# EAGLE design LB_BIT_2IN_1OUT-XL-v03(1_1x) (EAGLE 6.5.0)
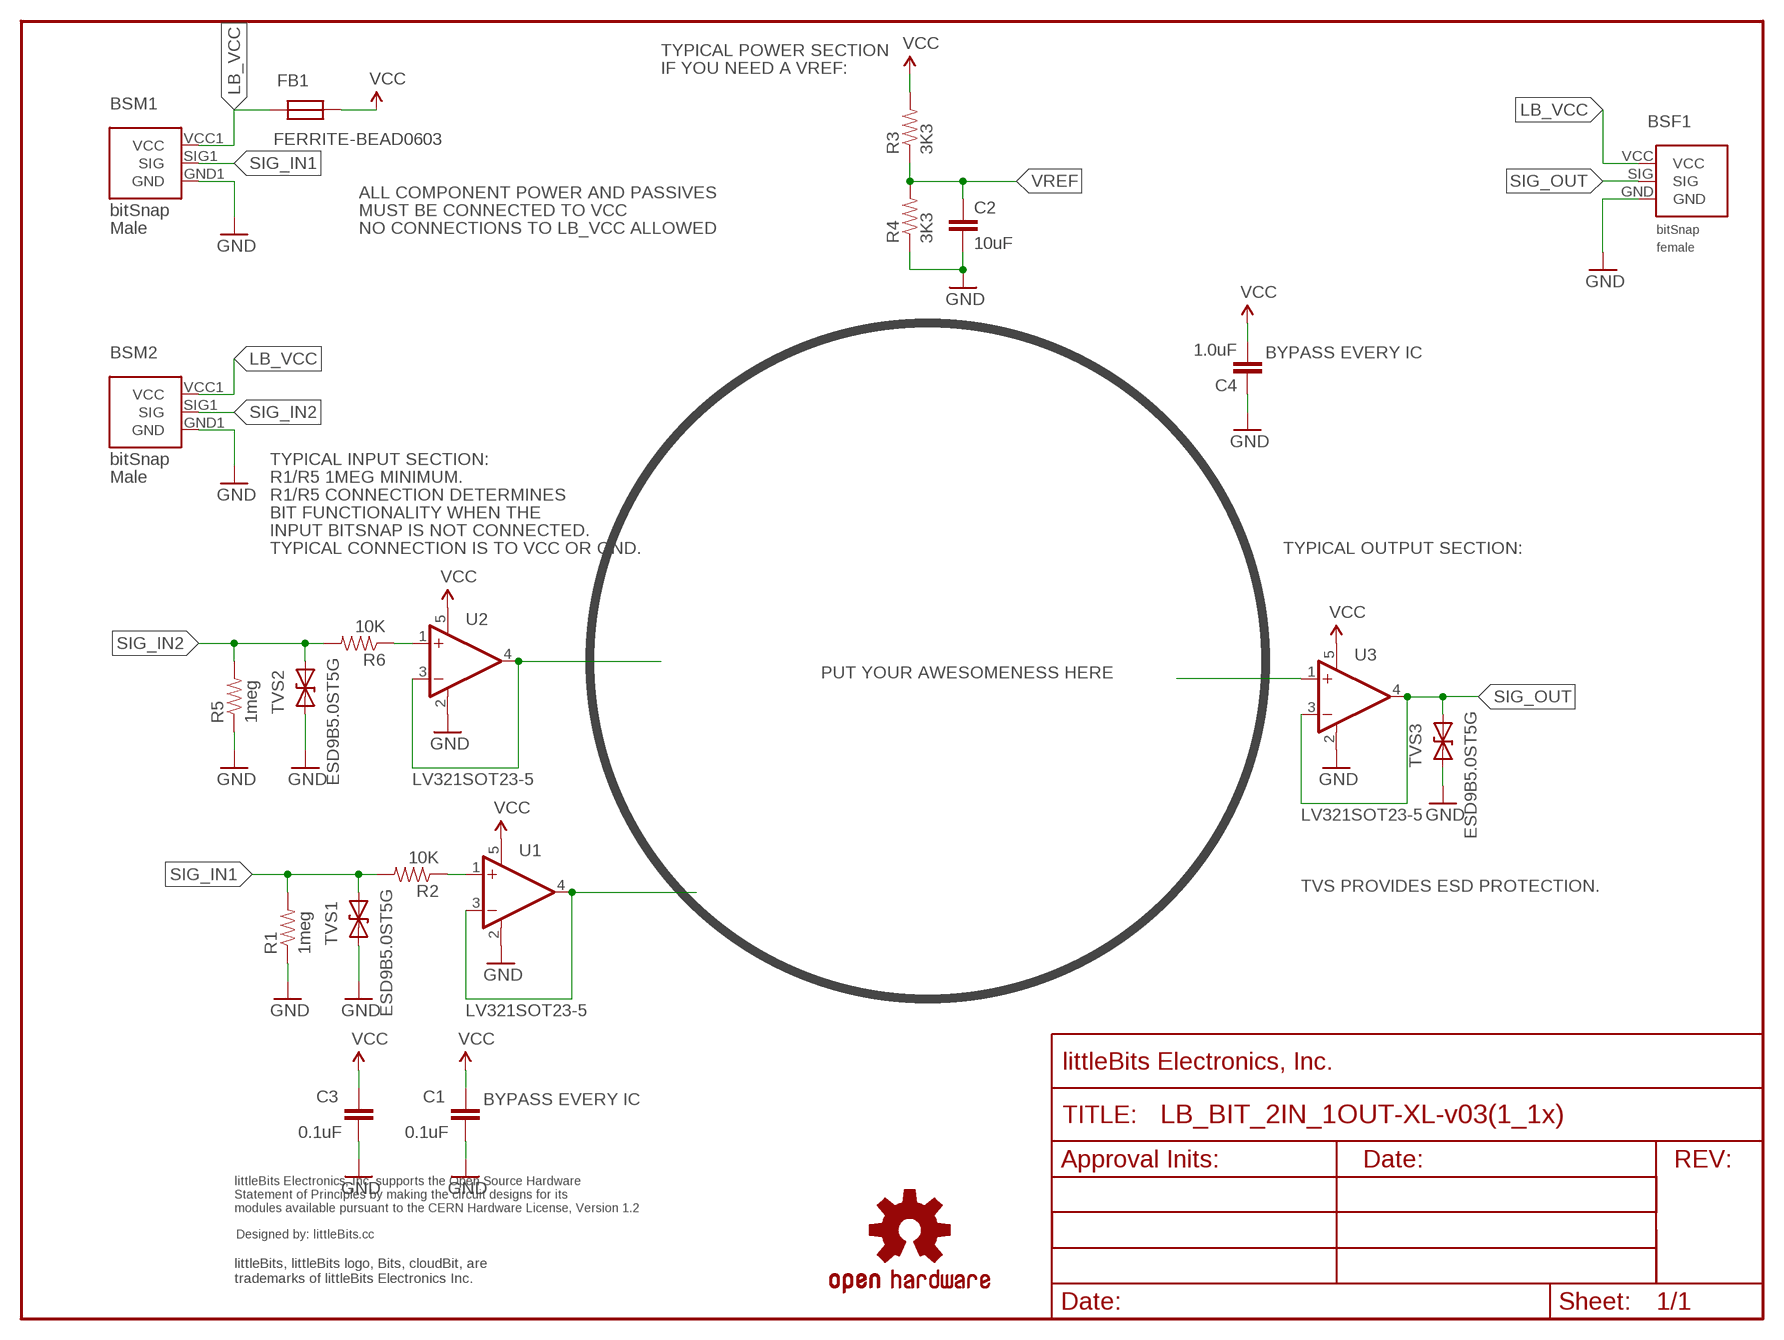
[diagram p0: schematic, sheet 1]

## Parts
BSF1  BITSNAP_V03_FEMALE  [BITSNAP_V03_FEMALE]
BSM1  BITSNAP_V03_MALE  [BITSNAP_V03_MALE]
BSM2  BITSNAP_V03_MALE  [BITSNAP_V03_MALE]
C1  0.1uF  CAPCAP-0603  [CAP-0603]
C2  10uF  CAPCAP-0603  [CAP-0603]
C3  0.1uF  CAPCAP-0603  [CAP-0603]
C4  1.0uF  CAPCAP-0603  [CAP-0603]
FB1  FERRITE-BEAD0603  [R0603]
FRAME1  FRAME-LETTER  [FABDWG01-OHW]
R1  1meg  RESISTOR0603  [RES-0603]
R2  10K  RESISTOR0603  [RES-0603]
R3  3K3  RESISTOR0603  [RES-0603]
R4  3K3  RESISTOR0603  [RES-0603]
R5  1meg  RESISTOR0603  [RES-0603]
R6  10K  RESISTOR0603  [RES-0603]
TVS1  ESD9B5.0ST5G  DIODE-TVSSOD-923  [SOD-923]
TVS2  ESD9B5.0ST5G  DIODE-TVSSOD-923  [SOD-923]
TVS3  ESD9B5.0ST5G  DIODE-TVSSOD-923  [SOD-923]
U1  LV321SOT23-5  [SOT23-5]
U2  LV321SOT23-5  [SOT23-5]
U3  LV321SOT23-5  [SOT23-5]
U$1  OSHW-LOGOL  [OSHW-LOGO-L]
U$3  OSHWCREDIT  [OSHWCREDIT]

## Nets
GND: BSF1.GND BSM1.GND1(GND) BSM2.GND1(GND) C1.2 C2.2 C3.2 C4.1 R1.1 R4.1 R5.1 TVS1.1(A) TVS2.1(A) TVS3.1(A) U1.2(V-) U2.2(V-) U3.2(V-)
LB_VCC: BSF1.VCC BSM1.VCC1(VCC) BSM2.VCC1(VCC) FB1.2
N$1: U2.3(-IN) U2.4(OUT)
N$2: R6.1 U2.1(+IN)
N$3: U1.3(-IN) U1.4(OUT)
N$4: R2.1 U1.1(+IN)
N$12: U3.1(+IN)
SIG_IN1: BSM1.SIG1(SIG) R1.2 R2.2 TVS1.2(C)
SIG_IN2: BSM2.SIG1(SIG) R5.2 R6.2 TVS2.2(C)
SIG_OUT: BSF1.SIG TVS3.2(C) U3.3(-IN) U3.4(OUT)
VCC: C1.1 C3.1 C4.2 FB1.1 R3.2 U1.5(V+) U2.5(V+) U3.5(V+)
VREF: C2.1 R3.1 R4.2

## Notes on the sheet
- TYPICAL POWER SECTION
- IF YOU NEED A VREF:
- ALL COMPONENT POWER AND PASSIVES
- MUST BE CONNECTED TO VCC
- NO CONNECTIONS TO LB_VCC ALLOWED
- BYPASS EVERY IC
- TYPICAL INPUT SECTION:
- R1/R5 1MEG MINIMUM.
- R1/R5 CONNECTION DETERMINES
- BIT FUNCTIONALITY WHEN THE
- INPUT BITSNAP IS NOT CONNECTED.
- TYPICAL CONNECTION IS TO VCC OR GND. | TYPICAL OUTPUT SECTION:
- PUT YOUR AWESOMENESS HERE
- TVS PROVIDES ESD PROTECTION.
- BYPASS EVERY IC

## Library data of the parts
BSF1 = bitSnap:BITSNAP_V03_FEMALE
BSM1 BSM2 = bitSnap:BITSNAP_V03_MALE
C1-C4 = LITTLEBITS:CAP
FB1 = LITTLEBITS:FERRITE-BEAD
FRAME1 = LITTLEBITS:FRAME-LETTER
R1-R6 = LITTLEBITS:RESISTOR
TVS1-TVS3 = LITTLEBITS:DIODE-TVS: Bidirectional Transient Voltage Suppression Diode: Device conducts in avalanche mode after reaching a part dependent voltage threshold. Used for limiting voltage spikes on ESD sensitive inputs and outputs.; IEC_ESD_PROT0: +/-18kV; LB_PN: ?; MPN: ESD9B5.0ST5G; V_CLAMP: ?; V_OPERATION: 5V
U1-U3 = LITTLEBITS:LV321
U$1 = LITTLEBITS131206:OSHW-LOGO: Open Source Hardware Logo This logo indicates the piece of hardware it is found on incorporates a OSHW license and/or adheres to the definition of open source hardware found here: http://freedomdefined.org/OSHW
U$3 = LITTLEBITS:OSHWCREDIT

## Board
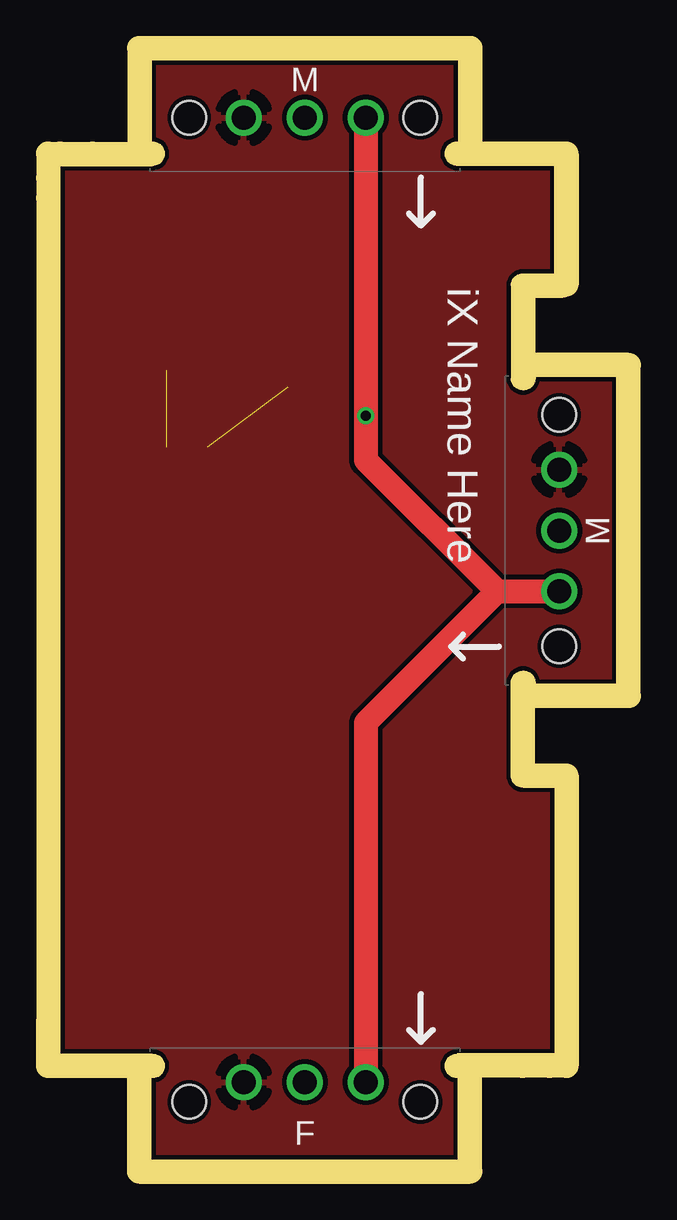
[diagram p1: board, top side]
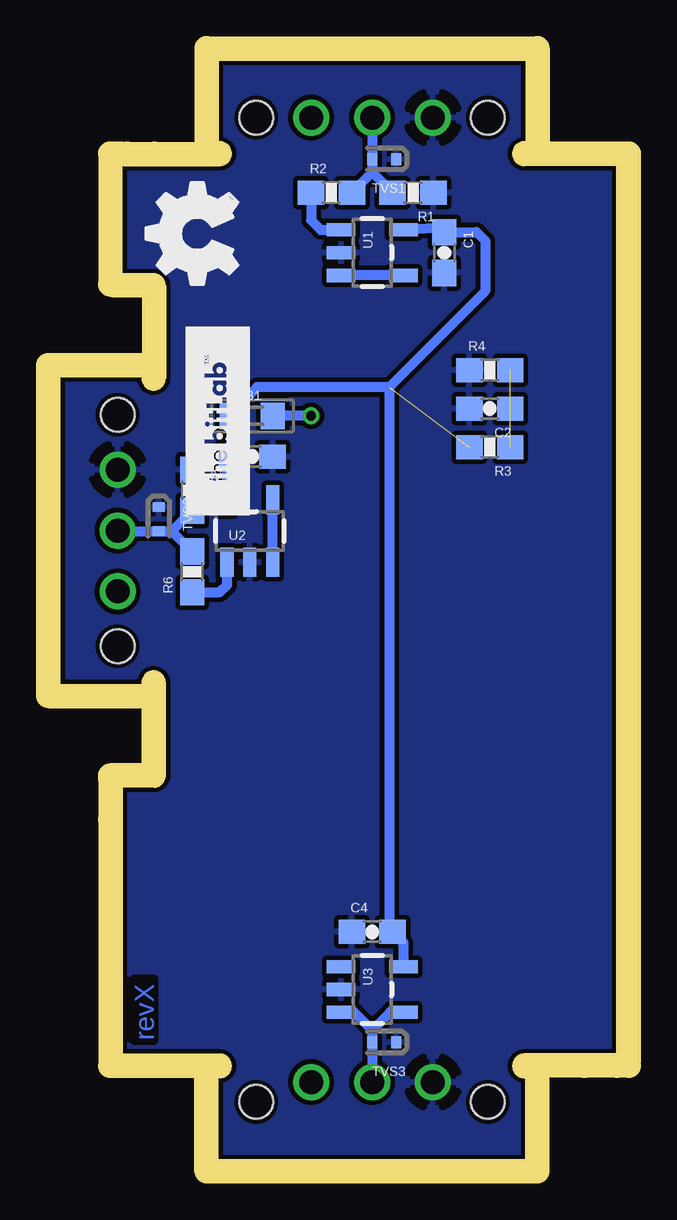
[diagram p2: board, bottom side, seen from below]

Size 23.2 x 45.81 mm. Coordinates in mm from the lower left corner, seen from the top.
Outline: 18.8,36.41 arc-90 19.3,36.91 20.61,36.91 20.61,41.41 20.4,41.41
Outline: 18.8,16.01 arc90 19.3,15.51 20.61,15.51 20.61,4.4 20.23,4.4
Outline: 0,41.41 0,4.4 0.03,4.4
Copper layers (1*16): Top 0.035mm / dielectric 1.5mm / Bottom 0.035mm
Design rules "littleBitsDRC": minimum track width 0.2mm, minimum drill 0.4mm, track to track 0.2mm, track to pad 0.2mm, pad to pad 0.2mm, via to via 0.2mm, smd to smd 0mil, copper to edge 0.2mm, drill to drill 0.2mm, minimum pad ring 0.2mm, minimum via ring 0.15mm, stop-mask expansion 0.1mm, vias tented up to drill 0mil, thermal gap 0.2mm
Milling: 13 lines

### Footprints (pad centres in the part's own frame; a part is rotated, then mirrored left to right if it is on the bottom)
BITSNAP_V03_FEMALE = drill 1: GND 4.065,3.44; SIG 6.605,3.44; VCC 9.145,3.44 | hole 1.4: 1.785,2.61; 11.425,2.61
BITSNAP_V03_MALE = drill 1: GND1 9.145,2.61; SIG1 6.605,2.61; VCC1 4.065,2.61 | hole 1.4: 1.785,2.61; 11.425,2.61
CAP-0603 = smd 1.1 x 1: 1 -0.85,0; 2 0.85,0
R0603 = smd 1 x 1.1: 1 -0.85,0; 2 0.85,0
RES-0603 = smd 1.1 x 1: 1 -0.85,0; 2 0.85,0
SOD-923 = smd 0.4 x 0.5: 1 -0.5,0; 2 0.5,0
SOT23-5 = smd 0.55 x 1.2: 1 -0.95,-1.3; 2 0,-1.3; 3 0.95,-1.3; 4 0.95,1.3; 5 -0.95,1.3

### Placement (x,y rotation side)
BSF1  3.6,-0.21 0 top
BSM1  16.8,46.02 180 top
BSM2  23.41,19.61 90 top
C1  7.19,37.79 270 bottom
C2  5.29,31.29 180 bottom
C3  15.19,29.29 0 bottom
C4  10.19,9.49 0 bottom
FB1  15.19,30.99 0 bottom
FRAME1  -3.01,-0.21 0 top  (outside the outline)
R1  8.49,40.29 180 bottom
R2  11.89,40.29 0 bottom
R3  5.29,29.69 180 bottom
R4  5.29,32.89 0 bottom
R5  17.69,27.89 270 bottom
R6  17.69,24.49 90 bottom
TVS1  9.69,41.69 180 bottom
TVS2  19.09,26.69 270 bottom
TVS3  9.69,4.89 180 bottom
U1  10.19,37.79 270 bottom
U2  15.29,26.19 0 bottom
U3  10.19,7.09 270 bottom
U$1  -40.52,-67.91 0 top  (outside the outline)
U$2  [BITLAB-LOGO]  15.29,34.69 270 top
U$3  -98.13,-62.29 0 top  (outside the outline)
U$8  [OSHW_FILLX150_NOTEXT]  15.8,35.63 0 top

### Tracks (layer width: path | path; a pad name or v marks a point on that pad's centre or on a via)
GND
  pour Bottom: -0.01,0.07 23.19,0.07 23.19,45.97 -0.01,45.97
  pour Top: -0.01,0.07 23.19,0.07 23.19,45.97 -0.01,45.97
LB_VCC  (via drill 0.4)
  Top 1: 18.21,23.67 BSM2.VCC1 | 18.21,23.67 12.74,18.2 BSF1.VCC | BSM1.VCC1 v12.74,30.99 12.74,29.14 18.21,23.67
  Bottom 0.406: v12.74,30.99 FB1.2
N$1
  Bottom 0.406: U2.3 U2.4
N$2
  Bottom 0.406: R6.1 16.54,23.64 16.24,23.94 U2.1
N$3
  Bottom 0.406: U1.4 U1.3
N$4
  Bottom 0.406: R2.1 12.74,39.14 12.34,38.74 U1.1
SIG_IN1
  Bottom 0.406: BSM1.SIG1 TVS1.2 10.19,41.14 | 10.19,41.14 R2.2 | R1.2 10.19,41.14
SIG_IN2
  Bottom 0.406: BSM2.SIG1 20.78,26.19 TVS2.2 18.54,26.19 | 18.54,26.19 R6.2 | R5.2 18.54,26.19
SIG_OUT
  Bottom 0.406: U3.4 9.44,6.14 10.19,5.39 | 10.19,5.39 TVS3.2 BSF1.SIG | U3.3 10.94,6.14 10.19,5.39
VCC  (1 unrouted)
  Bottom 0.406: U2.5 16.24,29.09 C3.1 FB1.1 16.04,31.14 14.99,32.19 9.49,32.19 | U1.5 7.29,38.84 C1.1 5.84,38.64 5.49,38.29 5.49,36.19 9.49,32.19 | 9.49,32.19 9.49,9.64 C4.2 8.89,9.04 U3.5
VREF  (2 unrouted)

### Text on the board
Bottom: revX
tPlace: iX Name Here